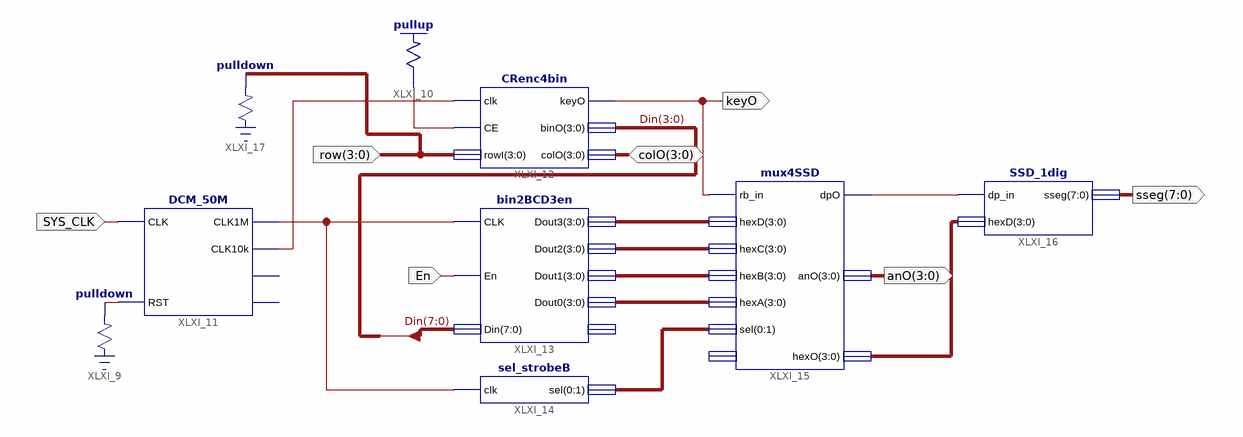
[diagram p0: schematic sheet 1]
// Xilinx ISE schematic Lab6_Ex4_V2.sch (spartan3e) as structural Verilog: 9 symbols, 7 ports
module Lab6_Ex4_V2 (
  input  [3:0] row,
  input  En,
  input  SYS_CLK,
  inout  [3:0] colO,
  output keyO,
  output [3:0] anO,
  output [7:0] sseg
);

  wire XLXN_7, XLXN_8, XLXN_37, XLXN_46, XLXN_47;
  wire [1:0] XLXN_34;
  wire [3:0] XLXN_17, XLXN_18, XLXN_19, XLXN_20, XLXN_36;
  wire [7:0] Din;

  \pulldown  XLXI_9 (.O(XLXN_7));
  \pullup  XLXI_10 (.O(XLXN_8));
  DCM_50M XLXI_11 (.CLK(SYS_CLK), .RST(XLXN_7), .CLK1M(XLXN_46), .CLK10k(XLXN_47));  // open: CLK1k, CLK1
  CRenc4bin XLXI_12 (.clk(XLXN_47), .CE(XLXN_8), .rowI(row), .colO(colO), .keyO(keyO), .binO(Din[3:0]));
  bin2BCD3en XLXI_13 (
    .CLK(XLXN_46), .En(En), .Din(Din), .Dout3(XLXN_17), .Dout2(XLXN_18), .Dout1(XLXN_19), .Dout0(XLXN_20));  // open: RBout
  sel_strobeB XLXI_14 (.clk(XLXN_46), .sel({XLXN_34[0], XLXN_34[1]}));
  mux4SSD XLXI_15 (
    .rb_in(keyO), .hexD(XLXN_17), .hexC(XLXN_18), .hexB(XLXN_19), .hexA(XLXN_20),
    .sel({XLXN_34[0], XLXN_34[1]}), .dpO(XLXN_37), .anO(anO), .hexO(XLXN_36));  // open: dp_in
  SSD_1dig XLXI_16 (.dp_in(XLXN_37), .hexD(XLXN_36), .sseg(sseg));
  \pulldown  XLXI_17 (.O(row));
endmodule
